# Altium project NiMH Battery Charger.PrjPcb
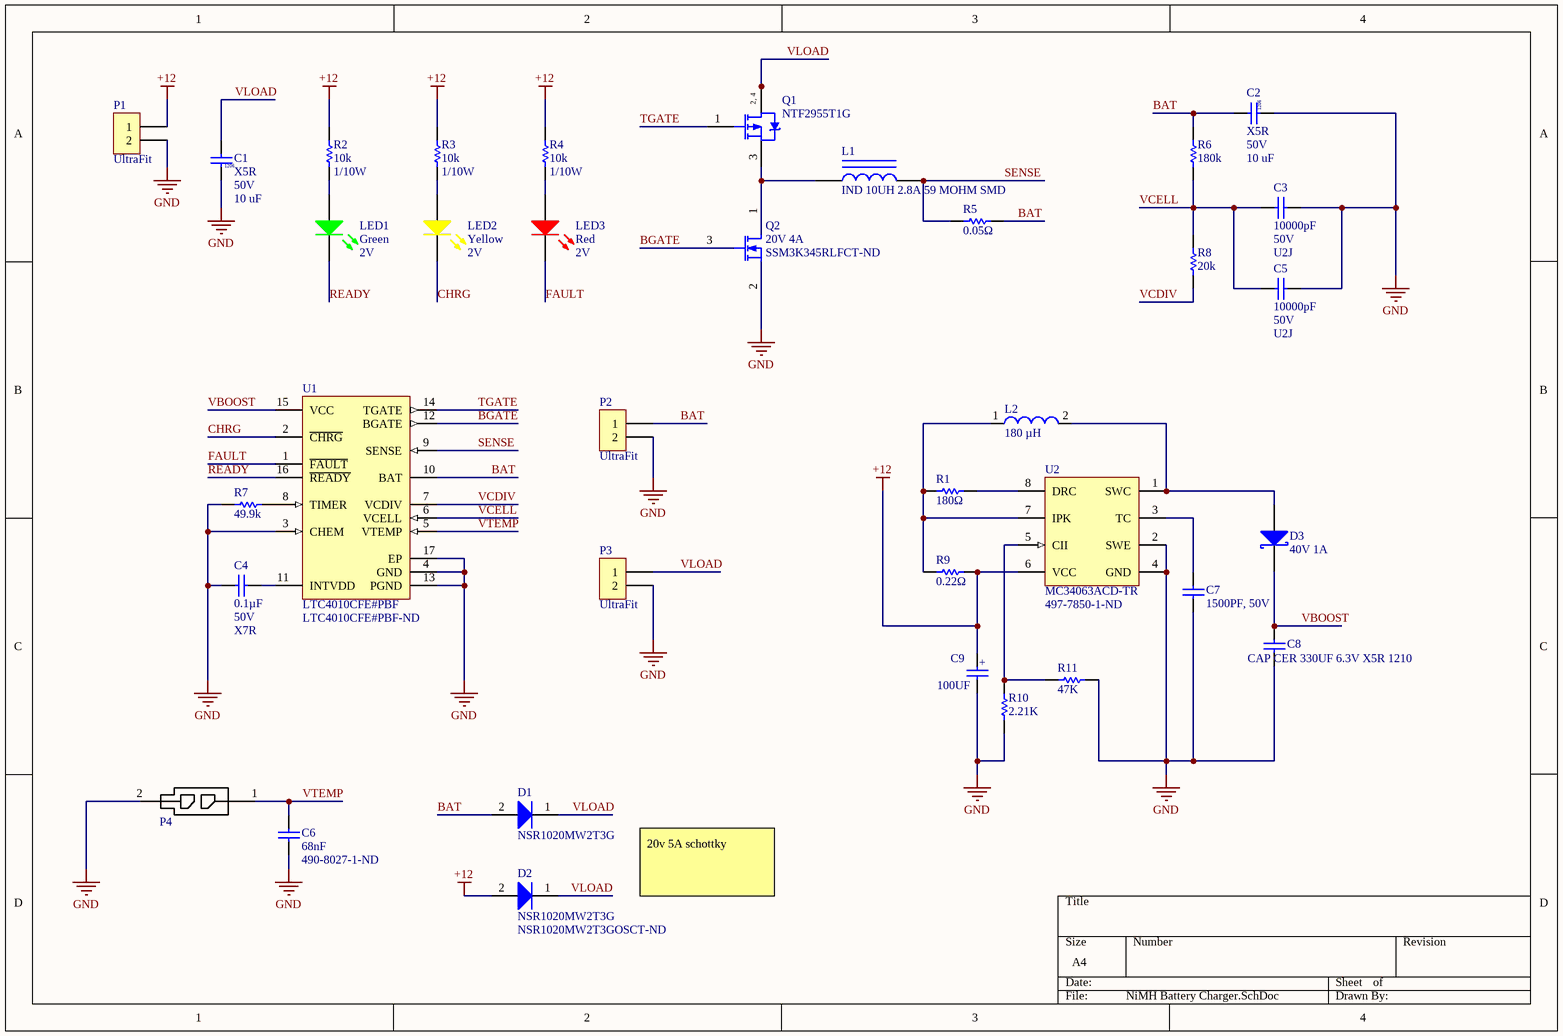
[diagram p0: NiMH Battery Charger.SchDoc]
1 sheet, 36 parts. Net scope: global (net labels, ports and power ports of the same name join across sheets).
Board file: NiMH Battery Charger Rev.PcbDoc

## Sheet NiMH Battery Charger.SchDoc
size A4

### Parts
C1  Rating: X5R  Voltage Rating: 50V  Capacitance: 10 uF  [CAP, 1206]  (hidden comment: CAP CER 10uF 50V 20% X5R 1206)
C2  Rating: X5R  Voltage Rating: 50V  Capacitance: 10 uF  [CAP, 1206]  (hidden comment: CAP CER 10uF 50V 20% X5R 1206)
C3  Capacitance: 10000pF  Voltage: 50V  Temperature Coefficient: U2J  [CAP, 0603]  (hidden comment: CAP CER 10nF 50V 5% X7R 0603)
C4  Capacitance: 0.1µF  Voltage: 50V  Temperature Coefficient: X7R  [CAP, 0603]  (hidden comment: CAP CER 0.1UF 50V 10% X7R 0603)
C5  Capacitance: 10000pF  Voltage: 50V  Temperature Coefficient: U2J  [CAP, 0603]  (hidden comment: CAP CER 10nF 50V 5% X7R 0603)
C6  68nF  Supplier Part Number 1: 490-8027-1-ND  [CAP, 0603]
C7  1500PF, 50V  [CAP, 0603]
C8  CAP CER 330UF 6.3V X5R 1210  [CAP, 1210]
C9  100UF  [CAP ALUM 6.3MM RADIAL SMD]
D1  NSR1020MW2T3G  [ONSC-SOD-323-2-477-02_V]
D2  NSR1020MW2T3G  Supplier Part Number 1: NSR1020MW2T3GOSCT-ND  [ONSC-SOD-323-2-477-02_V]
D3  40V 1A  [MELF]
L1  IND 10UH 2.8A 59 MOHM SMD  [INDP100102X31N]
L2  180 µH  [WE-PD-XL]
LED1  Color: Green  Voltage - Forward (Vf) (Typ): 2V  [LED_0603]  (hidden comment: LED GREEN CLEAR 2V 0603)
LED2  Color: Yellow  Voltage - Forward (Vf) (Typ): 2V  [LED_0603]  (hidden comment: LED YELLOW CLEAR 2.1V 0603)
LED3  Color: Red  Voltage - Forward (Vf) (Typ): 2V  [LED_0603]  (hidden comment: LED RED CLEAR 2V 0603)
P1  Series: UltraFit  [CONN, 2POS ULTRA-FIT]  (hidden comment: CONN 2POS ULTRA-FIT 0.138")
P2  Series: UltraFit  [CONN, 2POS ULTRA-FIT]  (hidden comment: CONN 2POS ULTRA-FIT 0.138")
P3  Series: UltraFit  [CONN, 2POS ULTRA-FIT]  (hidden comment: CONN 2POS ULTRA-FIT 0.138")
P4  CONN 2POS MICRO-FIT 3mm  [CONN, 2POS MICRO-FIT]  (value not drawn)
Q1  NTF2955T1G  [ONSC-SOT-223-4-318E-04_V]
Q2  20V 4A  Supplier Part Number 1: SSM3K345RLFCT-ND  [SOT23]
R1  180Ω  [RES, 0603]
R2  Resistance: 10k  Power: 1/10W  [RES, 0603]  (hidden comment: RES 10K OHM 1% 1/10W 0603)
R3  Resistance: 10k  Power: 1/10W  [RES, 0603]  (hidden comment: RES 10K OHM 1% 1/10W 0603)
R4  Resistance: 10k  Power: 1/10W  [RES, 0603]  (hidden comment: RES 10K OHM 1% 1/10W 0603)
R5  0.05Ω  [RES, 0603]
R6  180k  [RES, 0603]
R7  49.9k  [RES, 0603]
R8  20k  [RES, 0603]
R9  0.22Ω  [RES, 0603]
R10  2.21K  [RES, 0603]
R11  47K  [RES, 0603]
U1  LTC4010CFE#PBF  Supplier Part Number 1: LTC4010CFE#PBF-ND  [LT-FE-16-EPV-BC_L]
U2  MC34063ACD-TR  Supplier Part Number 1: 497-7850-1-ND  [SO8_N]

### Nets
+12: C9.1 D2.2(A) P1.1 R2.1 R3.1 R4.1 R9.1 U2.6(VCC)
GND: C1.2 C2.2 C3.2 C4.2 C5.2 C6.2 C7.2 C8.2 C9.2 P1.2 P2.2 P3.2 P4.2 Q2.2 R7.1 R10.2 R11.2 U1.3(CHEM) U1.4(GND) U1.13(PGND) U1.17(EP) U2.2(SWE) U2.4(GND)
BAT: C2.1 D1.2(A) P2.1 R5.2 R6.2 U1.10(BAT)
BGATE: Q2.3 U1.12(BGATE)
CHRG: LED2.2(K) U1.2(~{CHRG})
FAULT: LED3.2(K) U1.1(~{FAULT})
READY: LED1.2(K) U1.16(~{READY})
SENSE: L1.2 R5.1 U1.9(SENSE)
TGATE: Q1.1(G) U1.14(TGATE)
VBOOST: C8.1 D3.2(K) U1.15(VCC)
VCDIV: R8.1 U1.7(VCDIV)
VCELL: C3.1 C5.1 R6.1 R8.2 U1.6(VCELL)
VLOAD: C1.1 D1.1(K) D2.1(K) P3.1 Q1.2(D) Q1.4(D)
VTEMP: C6.1 P4.1 U1.5(VTEMP)
NetC4_1: C4.1 U1.11(INTVDD)
NetC7_1: C7.1 U2.3(TC)
NetD3_1: D3.1(A) L2.2 U2.1(SWC)
NetL1_1: L1.1 Q1.3(S) Q2.1
NetL2_1: L2.1 R1.2 R9.2 U2.7(IPK)
NetLED1_1: LED1.1(A) R2.2
NetLED2_1: LED2.1(A) R3.2
NetLED3_1: LED3.1(A) R4.2
NetR1_1: R1.1 U2.8(DRC)
NetR7_2: R7.2 U1.8(TIMER)
NetR10_1: R10.1 R11.1 U2.5(CII)

### Notes on the sheet
- 20v 5A schottky
- (in symbol CAP ALUM 100UF 20% 35V SMD) +
- (in symbol ONSC-PMOS-G1D2S3D4-4) 2, 4

### Library data of the parts
C1 C2 = CAP CER 10uF 50V 20% X5R 1206: 10µF ±20% 50V Ceramic Capacitor X5R 1206 (3216 Metric) /; Manufacturer: Murata; Manufacturer Part Number: GRT31CR61H106ME01L; Supplier 1: Digi-Key; Supplier Part Number 1: 490-12457-1-ND; RoHS: Yes; Stock 1: 449467; Pricing 1: 1 = 0.57000, 10 = 0.39800, 100 = 0.23910, 500 = 0.17930, 1000 = 0.15141 (USD); Mount: Surface Mount; Case/Package: 1206; Case Code (Metric): 3216; Case Code (Imperial): 1206; Min Operating Temperature: -55°C; Max Operating Temperature: 85°C; Packaging: Tape and Reel; Tolerance: 20%; Length: 0.126inch; Width: 0.063inch; Thickness: 0.071inch; Ratings: AEC-Q200
C3 C5 = CAP CER 10nF 50V 5% X7R 0603: 10000pF ±5% 50V Ceramic Capacitor U2J 0603 (1608 Metric); Manufacturer 1: KEMET; Manufacturer Part Number 1: C0603C103J5JAC7867; Supplier 1: Digi-Key; Supplier Part Number 1: 399-13384-1-ND; Packaging: Cut Tape (CT); Part Status: Active; Operating Temperature: -55°C ~ 125°C; Ratings: -; Failure Rate: -; Mounting Type: Surface Mount, MLCC; Package / Case: 0603 (1608 Metric); Size / Dimension: 0.063" L x 0.032" W (1.60mm x 0.80mm); Height - Seated (Max): -; Thickness (Max): 0.034" (0.87mm); Lead Spacing: -; Lead Style: -; ComponentLink1URL: http://www.kemet.com/docfinder?Partnumber=C0603C103J5JAC7867; ComponentLink1Description: http://www.kemet.com/docfinder?Partnumber=C0603C103J5JAC7867; Tolerance: ±5%
C4 = CAP CER 0.1UF 50V 10% X7R 0603: 0.10µF ±10% 50V Ceramic Capacitor X7R 0603 (1608 Metric); Manufacturer 1: AVX Corporation; Manufacturer Part Number 1: 06035C104KAT2A; Supplier 1: Digi-Key; Supplier Part Number 1: 478-5052-1-ND; Packaging: Cut Tape (CT); Part Status: Active; Operating Temperature: -55°C ~ 125°C; Ratings: -; Mounting Type: Surface Mount, MLCC; Package / Case: 0603 (1608 Metric); Size / Dimension: 0.063" L x 0.032" W (1.60mm x 0.81mm); Height - Seated (Max): -; Thickness (Max): 0.035" (0.90mm); Lead Spacing: -; Lead Style: -; ComponentLink1URL: http://datasheets.avx.com/X7RDielectric.pdf; ComponentLink1Description: http://datasheets.avx.com/X7RDielectric.pdf; Tolerance: ±10%
C6 = CAP CER 0.068UF 10% 50V X7R 0603: 0.068µF 50V Ceramic Capacitor X7R 0603 (1608 Metric) 0.063" L x 0.032" W (1.60mm x 0.80mm); Manufacturer: Murata; Manufacturer Part Number: GCM188R71H683KA57D; Tolerance: 10%; Supplier 1: Digi-Key; Stock 1: 40000; Pricing 1: 1=0.16, 10=0.116, 100=0.0547, 500=0.03832, 1000=0.03172 (USD); Mount: Surface Mount; Case/Package: 0603; Case Code (Metric): 1608; Case Code (Imperial): 0603; Min Operating Temperature: -55°C; Max Operating Temperature: 125°C; Packaging: Tape and Reel; Capacitance: 68nF; Package Quantity: 4000; Voltage Rating: 50V; Dielectric: X7R; Voltage Rating (DC): 50V; Termination: SMD/SMT; Length: 1.6mm; Height: 0.8mm; Width: 0.031inch; Thickness: 0.035inch; Depth: 0.8mm; Radiation Hardening: No; ComponentLink1URL: https://datasheet.ciiva.com/29542/s0717e-29542427.pdf; ComponentLink1Description: https://datasheet.ciiva.com/29542/s0717e-29542427.pdf; ComponentLink2URL: https://datasheet.ciiva.com/29542/s0717e-29542428.pdf; ComponentLink2Description: https://datasheet.ciiva.com/29542/s0717e-29542428.pdf; ComponentLink3URL: https://datasheet.ciiva.com/29542/s0717e-29542429.pdf; ComponentLink3Description: https://datasheet.ciiva.com/29542/s0717e-29542429.pdf
C7 = CAP, 1500PF, 50V, 10%, X7R, 0603: KEMET - C0603C152K5RACTU - CAP, 1500PF, 50V, 10%, X7R, 0603; Dielectric Material: Ceramic; Capacitance: 1.5nF; Dissipation Factor: 2.5%; Supplier 1: Digi-Key; Manufacturer 1: KEMET; Manufacturer Part Number 1: C0603C152K5RACTU; Stock 1: 207623; Pricing 1: 1=0.10000, 10=0.05000, 100=0.02230, 500=0.01594, 1000=0.01252 (USD); RoHS: Yes; Mount: Surface Mount,PCB; Case/Package: 0603; Number of Pins: 2; Case Code (Metric): 1608; Case Code (Imperial): 0603; Contact Plating: Tin,Matte; Min Operating Temperature: -55°C; Max Operating Temperature: 125°C; Tolerance: 10%; Voltage Rating: 50V; Packaging: Tape and Reel; Package Quantity: 1; Voltage Rating (DC): 50V; Dielectric: X7R; Termination: SMD/SMT; Voltage: 50V; Length: 1.6mm; Height: 0.8mm; Width: 0.8mm; Thickness: 0.034inch; Depth: 0.8mm; Lead Pitch: 0.7mm; Radiation Hardening: No; REACH SVHC: No SVHC; ComponentLink1URL: https://datasheet.ciiva.com/7824/kem-c1002-x7r-smd-7824006.pdf?src-supplier=Element14; ComponentLink1Description: https://datasheet.ciiva.com/7824/kem-c1002-x7r-smd-7824006.pdf?src-supplier=Element14; ComponentLink2URL: https://datasheet.ciiva.com/28645/1851736-28645673.pdf?src-supplier=Element14; ComponentLink2Description: https://datasheet.ciiva.com/28645/1851736-28645673.pdf?src-supplier=Element14; ComponentLink3URL: https://datasheet.ciiva.com/7823/40889-7823642.pdf?src-supplier=Element14; ComponentLink3Description: https://datasheet.ciiva.com/7823/40889-7823642.pdf?src-supplier=Element14; ComponentLink4URL: https://datasheet.ciiva.com/18192/getdatasheetpartid-104358-18192810.pdf?src-supplier=Verical; ComponentLink4Description: https://datasheet.ciiva.com/18192/getdatasheetpartid-104358-18192810.pdf?src-supplier=Verical; ComponentLink5URL: https://datasheet.ciiva.com/7823/40889-7823643.pdf?src-supplier=Element14; ComponentLink5Description: https://datasheet.ciiva.com/7823/40889-7823643.pdf?src-supplier=Element14; ComponentLink6URL: https://datasheet.ciiva.com/6177/kem-c1002-x7r-smd-6177916.pdf?src-supplier=Farnell; ComponentLink6Description: https://datasheet.ciiva.com/6177/kem-c1002-x7r-smd-6177916.pdf?src-supplier=Farnell; ComponentLink7URL: https://datasheet.ciiva.com/14597/70095383-14597806.pdf?src-supplier=Allied+Electronics; ComponentLink7Description: https://datasheet.ciiva.com/14597/70095383-14597806.pdf?src-supplier=Allied+Electronics
C8 = CAP CER 330UF 6.3V X5R 1210: 330µF ±20% 6.3V Ceramic Capacitor X5R 1210 (3225 Metric); Manufacturer: Taiyo Yuden; Manufacturer Part Number: JMK325ABJ337MM-P; Supplier 1: Digi-Key; Stock 1: 1427; Pricing 1: 1=5.57, 10=4.492, 100=3.5039, 500=2.6055 (USD); Supplier Part Number 1: 587-5449-1-ND
C9 = CAP ALUM 100UF 20% 35V SMD: 100µF 35V Aluminum Electrolytic Capacitors Radial, Can - SMD 2000 Hrs @ 85°C; Manufacturer 1: Panasonic; Manufacturer Part Number 1: EEE-1VA101XP; Description 1: Cap Aluminum Lytic 100uF 35V 20% (6.3 X 7.7mm) SMD 132mA 2000h 85C Automotive T/R; Tolerance: 20%; Ripple Current: 132mA; Polarity: Polar; Life (Hours): 2000Hour; Leakage Current: 3uA; Supplier 1: Digi-Key; Supplier Part Number 1: PCE3951CT-ND; Stock 1: 170823; Pricing 1: 1=0.44, 10=0.304, 100=0.1822 (USD); Mount: Surface Mount,PCB; Case/Package: Radial; Number of Pins: 8; Contact Plating: Tin; Min Operating Temperature: -40°C; Max Operating Temperature: 85°C; Capacitance: 100uF; Voltage Rating: 35V; Packaging: Tape and Reel; Package Quantity: 900; Ripple Current (AC): 132mA; Voltage Rating (DC): 35V; Termination: SMD/SMT; Voltage: 35V; Diameter: 6.3mm; Length: 8mm; Height: 7.7mm; Height - Seated (Max): 0.303inch; Radiation Hardening: No; REACH SVHC: No SVHC; Lead Free: Lead Free; ComponentLink1URL: https://datasheet.ciiva.com/46378/aba0000ce2-46378341.pdf; ComponentLink1Description: https://datasheet.ciiva.com/46378/aba0000ce2-46378341.pdf; ComponentLink2URL: https://datasheet.ciiva.com/17535/aba0000ce2-17535510.pdf; ComponentLink2Description: https://datasheet.ciiva.com/17535/aba0000ce2-17535510.pdf; ComponentLink3URL: https://datasheet.ciiva.com/30170/11aba0000ce2-30170103.pdf; ComponentLink3Description: https://datasheet.ciiva.com/30170/11aba0000ce2-30170103.pdf; ComponentLink4URL: https://datasheet.ciiva.com/31414/aba0000ce2-31414696.pdf; ComponentLink4Description: https://datasheet.ciiva.com/31414/aba0000ce2-31414696.pdf; ComponentLink5URL: https://datasheet.ciiva.com/24068/aba0000ce2-40801-24068089.pdf; ComponentLink5Description: https://datasheet.ciiva.com/24068/aba0000ce2-40801-24068089.pdf; ComponentLink6URL: https://datasheet.ciiva.com/14591/70255710-14591771.pdf; ComponentLink6Description: https://datasheet.ciiva.com/14591/70255710-14591771.pdf; ComponentLink7URL: https://datasheet.ciiva.com/14600/70255710-14600731.pdf; ComponentLink7Description: https://datasheet.ciiva.com/14600/70255710-14600731.pdf; ComponentLink8URL: https://datasheet.ciiva.com/46374/aba0000ce2-46374427.pdf; ComponentLink8Description: https://datasheet.ciiva.com/46374/aba0000ce2-46374427.pdf; ComponentLink9URL: https://datasheet.ciiva.com/11673/aba0000ce2-11673887.pdf; ComponentLink9Description: https://datasheet.ciiva.com/11673/aba0000ce2-11673887.pdf
D1 = CMP-1055-00469-1: Schottky Barrier Diode, 2-Pin SOD-323, Pb-Free, Tape and Reel; Manufacturer: On Semiconductor; IFSM Max (A): 5; Configuration: Single; PartNumber: NSR1020MW2T3G; RoHS: TRUE; ComponentLink2Description: Datasheet; PackageVersion: Rev. H, 03/2007; ComponentLink3Description: Package Specification; ComponentLink1Description: Manufacturer URL; DatasheetVersion: Rev. 1; PackageDescription: 2-Pin SOD, Body 1.7 x 1.25 mm; ComponentLink2URL: http://www.onsemi.cn/pub_link/Collateral/NSR1020MW2T1-D.PDF; Packing: Tape and Reel; ComponentLink3URL: http://www.onsemi.com/pub_link/Collateral/477-02.PDF.1; PackageReference: SOD-323-2-477-02; ComponentLink1URL: http://www.onsemi.com/; Mounting Technology: Surface Mount
D2 = DIODE Schottky Barrier 20V: Schottky Barrier Diode, 2-Pin SOD-323, Pb-Free, Tape and Reel; Manufacturer: On Semiconductor; IFSM Max (A): 5; Configuration: Single; PartNumber: NSR1020MW2T3G; RoHS: TRUE; ComponentLink2Description: Datasheet; PackageVersion: Rev. H, 03/2007; ComponentLink3Description: Package Specification; ComponentLink1Description: Manufacturer URL; DatasheetVersion: Rev. 1; PackageDescription: 2-Pin SOD, Body 1.7 x 1.25 mm; ComponentLink2URL: http://www.onsemi.cn/pub_link/Collateral/NSR1020MW2T1-D.PDF; Packing: Tape and Reel; ComponentLink3URL: http://www.onsemi.com/pub_link/Collateral/477-02.PDF.1; PackageReference: SOD-323-2-477-02; ComponentLink1URL: http://www.onsemi.com/; Mounting Technology: Surface Mount; Supplier 1: Digi-Key
D3 = DIODE SCHOTTKY 40V 1A MELF: Diode Schottky 40V 1A Surface Mount MELF
L1 = IND 10UH 2.8A 59 MOHM SMD: 10µH Shielded Inductor 2.8A 59 mOhm Max Nonstandard; Manufacturer: Sumida; Manufacturer Part Number: CDRH103RNP-100NC-B; Core Material: Ferrite; Tolerance: 30%; Saturation Current: 3.18A; DC Resistance (DCR): 59mR; Test Frequency: 100kHz; Supplier 1: Digi-Key; Stock 1: 69; Pricing 1: 1=1.53, 10=1.42, 100=1.027, 500=0.7866 (USD); Mount: Surface Mount; Case/Package: Nonstandard; Min Operating Temperature: -40°C; Max Operating Temperature: 100°C; Packaging: Tape and Reel; Package Quantity: 1000; Current Rating: 2.8A; Shielding: Shielded; Inductance: 10uh; Max DC Current: 2.8A; Termination: SMD/SMT; Length: 0.402inch; Height: 3.1mm; Width: 0.394inch; Height - Seated (Max): 0.122inch; Depth: 10.3mm; Radiation Hardening: No; Lead Free: Lead Free; ComponentLink1URL: http://www.mouser.com/ds/2/390/CDRH103R-523372.pdf; ComponentLink1Description: http://www.mouser.com/ds/2/390/CDRH103R-523372.pdf; ComponentLink2URL: http://www.sumida.com/products/pdf/CDRH103R.pdf; ComponentLink2Description: http://www.sumida.com/products/pdf/CDRH103R.pdf; ComponentLink3URL: http://products.sumida.com/products/pdf/CDRH103R.pdf; ComponentLink3Description: http://products.sumida.com/products/pdf/CDRH103R.pdf; Supplier Part Number 1: 308-1910-1-ND
L2 = IND 180 µH Power Inductor: SMD-Shielded Power Inductor WE-PD, L = 180 µH; Inductance: 180 ÂµH; ComponentLink1URL: http://www.we-online.com; DatasheetVersion: ver 5, Oct-2004; ComponentLink1Description: Manufacturer Link; ComponentLink2URL: http://www.we-online.de/katalog/media/pdf/744770218.pdf; PackageDescription: SMD Inductor, 2-Leads, Body 12.0 x 12.0 mm; PackageReference: WE-PD-XL; ComponentLink2Description: Datasheet; PackageVersion: 2004
LED1 = LED GREEN CLEAR 2V 0603: Green 572nm LED Indication - Discrete 2V 0603 (1608 Metric); Manufacturer: Wurth Electronics Inc.; Manufacturer Part Number: 150060VS75000; Lens Color: Colorless; Millicandela Rating: 40mcd; Lens Style/Size: Rectangle with Flat Top, 1.10mm x 0.70mm; Current - Test: 20mA; Viewing Angle: 140°; Wavelength - Dominant: 570nm; Supplier 1: Digi-Key; RoHS: RoHS Compliant; Category: Optoelectronics; Stock 1: 9408; Pricing 1: 1=0.21, 100=0.1617, 500=0.13964 (CAD); Packaging: Cut Tape (CT); Part Status: Active; Lens Transparency: Clear; Mounting Type: Surface Mount; Wavelength - Peak: 572nm; Features: -; Package / Case: 0603 (1608 Metric); Supplier Device Package: 0603; Size / Dimension: 1.60mm L x 0.80mm W; Height (Max): 0.80mm; ComponentLink1URL: http://katalog.we-online.de/led/datasheet/150060VS75000.pdf; ComponentLink1Description: http://katalog.we-online.de/led/datasheet/150060VS75000.pdf; Supplier Part Number 1: 732-4980-1-ND
LED2 = LED YELLOW CLEAR 2.1V 0603: Yellow 590nm LED Indication - Discrete 2V 0603 (1608 Metric); Manufacturer: Wurth Electronics Inc.; Manufacturer Part Number: 150060YS75000; Lens Color: Colorless; Millicandela Rating: 120mcd; Lens Style/Size: Rectangle with Flat Top, 1.10mm x 0.70mm; Current - Test: 20mA; Viewing Angle: 140°; Wavelength - Peak: 595nm; Supplier 1: Digi-Key; RoHS: RoHS Compliant; Category: Optoelectronics; Stock 1: 10523; Pricing 1: 1=0.21, 100=0.1617, 500=0.13964 (CAD); Packaging: Cut Tape (CT); Part Status: Active; Lens Transparency: Clear; Mounting Type: Surface Mount; Wavelength - Dominant: 590nm; Features: -; Package / Case: 0603 (1608 Metric); Supplier Device Package: 0603; Size / Dimension: 1.60mm L x 0.80mm W; Height (Max): 0.80mm; ComponentLink1URL: http://katalog.we-online.de/led/datasheet/150060YS75000.pdf; ComponentLink1Description: http://katalog.we-online.de/led/datasheet/150060YS75000.pdf; Supplier Part Number 1: 732-4981-1-ND
LED3 = LED RED CLEAR 2V 0603: Red 631nm LED Indication - Discrete 2V 0603 (1608 Metric); Manufacturer: Wurth Electronics Inc.; Manufacturer Part Number: 150060RS75000; Lens Color: Colorless; Millicandela Rating: 250mcd; Lens Style/Size: Rectangle with Flat Top, 1.10mm x 0.70mm; Current - Test: 20mA; Viewing Angle: 140°; Wavelength - Dominant: 625nm; Wavelength - Peak: 630nm; Supplier 1: Digi-Key; RoHS: RoHS Compliant; Category: Optoelectronics; Stock 1: 35521; Pricing 1: 1=0.21, 100=0.1617, 500=0.13964 (CAD); Packaging: Cut Tape (CT); Part Status: Active; Lens Transparency: Clear; Mounting Type: Surface Mount; Features: -; Package / Case: 0603 (1608 Metric); Supplier Device Package: 0603; Size / Dimension: 1.60mm L x 0.80mm W; Height (Max): 0.80mm; ComponentLink1URL: http://katalog.we-online.de/led/datasheet/150060RS75000.pdf; ComponentLink1Description: http://katalog.we-online.de/led/datasheet/150060RS75000.pdf; Supplier Part Number 1: 732-4978-1-ND
P1-P3 = CONN 2POS ULTRA-FIT 0.138": Connector Header Through Hole 2 position 0.138" (3.50mm); Manufacturer: Molex; Manufacturer Part Number: 1722871102; Number of Positions: 2; Connector Type: Male Pin; Pitch: 0.138inch; ComponentLink1URL: http://www.molex.com/pdm_docs/sd/1722861302_sd.pdf; ComponentLink1Description: http://www.molex.com/pdm_docs/sd/1722861302_sd.pdf; Supplier 1: Digi-Key; RoHS: Yes; Stock 1: 2743; Pricing 1: 1 = 0.78000, 10 = 0.68800, 100 = 0.59380, 500 = 0.48582, 1000 = 0.43184, 5000 = 0.37786, 10000 = 0.35897 (USD); Mount: Through Hole; Color: Black; Contact Plating: Tin; Packaging: Tray; Number of Rows: 1; Termination: Solder; Fastening Type: Latch; Supplier Part Number 1: WM11701-ND
P4 = CONN 2POS MICRO-FIT 3mm: Connector Header Through Hole 2 position; Manufacturer: Molex; Manufacturer Part Number: 43045-0227; Number of Positions: 2; Gender: Male; Contact Resistance: 10mR; Number of Ports: 1; Max Voltage Rating (DC): 250.25kV; Current Rating: 5A; Voltage Rating: 600V; Glow Wire Compliant: Compliant; Supplier 1: Digi-Key; Stock 1: 3657; Pricing 1: 1=0.84, 10=0.74, 25=0.6968, 50=0.6676, 100=0.6387, 250=0.5806, 500=0.52254, 1000=0.46448, 2500=0.42094 (USD); Mount: Through Hole; Contact Plating: Tin; Contact Material: Brass; Housing Colour: Black; Housing Material: Thermoplastic; Number of Terminals: 2; Min Operating Temperature: -40°C; Max Operating Temperature: 105°C; Number of Rows: 2; Packaging: Tray; Termination: Solder; Number of Contacts: 2; Orientation: Vertical; Package Quantity: 3168; Number of Circuits: 2; Length: 7.15mm; Pitch: 3mm; Depth: 8.77mm; Row Spacing: 3mm; Radiation Hardening: No; Halogen Free: Low Halogen; ComponentLink1URL: http://www.onlinecomponents.com/productFiles/mf-MOL/307170430450227_pcb_headers.pdf; ComponentLink1Description: http://www.onlinecomponents.com/productFiles/mf-MOL/307170430450227_pcb_headers.pdf; ComponentLink2URL: http://www.mouser.com/ds/2/276/0430450227_PCB_HEADERS-142611.pdf; ComponentLink2Description: http://www.mouser.com/ds/2/276/0430450227_PCB_HEADERS-142611.pdf; ComponentLink3URL: http://uk.rs-online.com/webdocs/13c3/0900766b813c3a46.pdf; ComponentLink3Description: http://uk.rs-online.com/webdocs/13c3/0900766b813c3a46.pdf; ComponentLink4URL: http://www.molex.com/webdocs/datasheets/pdf/en-us/0430450227_PCB_HEADERS.pdf; ComponentLink4Description: http://www.molex.com/webdocs/datasheets/pdf/en-us/0430450227_PCB_HEADERS.pdf; Supplier Part Number 1: WM10657-ND
Q1 = ONSC-PMOS-G1D2S3D4-4: Power MOSFET, -60 V, -2.6 A, Single P-Channel, 4-Pin SOT-223, Pb-Free, Tape and Reel; Manufacturer: On Semiconductor; Ciss Typ (pF): 492; Coss Typ (pF): 165; VGS(th) Max (V): 4; VGS Max (V): 20; ID Max (A): 2.6; Crss Typ (pF): 50; Channel Polarity: P Channel; V(BR)DSS Min (V): 60; Qrr Typ (nC): 0.139; Mounting Technology: Surface Mount; RoHS: Pb-Free; ComponentLink3URL: http://www.onsemi.com/pub_link/Collateral/318E-04.PDF; Packing: Tape and Reel; ComponentLink1URL: http://www.onsemi.com/; PackageReference: SOT-223-4-318E-04; Configuration: Single; PartNumber: NTF2955T1G; ComponentLink3Description: Package Specification; DatasheetVersion: Rev. 6; ComponentLink2Description: Datasheet; ComponentLink2URL: http://www.onsemi.com/pub_link/Collateral/NTF2955-D.PDF; PackageDescription: 4-Pin Small Outline Transistor, Body 6.5 x 3.5 mm, Pitch 2.3 mm; Package Type: SOT-223-4 / TO-261-4; ComponentLink1Description: Manufacturer URL; PackageVersion: Rev. N, 08/2009
Q2 = MOSFET N-CHANNEL 20V 4A SOT23F: N-Channel 20V 4A (Ta) 1W (Ta) Surface Mount SOT-23F; Supplier 1: Digi-Key; ComponentLink1Description: datasheet; ComponentLink1URL: https://toshiba.semicon-storage.com/info/docget.jsp?did=55842&prodName=SSM3K345R
R1 R9 = RES 180k Ohms: Manufacturer: Vishay Dale; Part Number: CRCW0402180KFKED; Supplier 1: Digi-Key
R2-R4 = RES 10K OHM 1% 1/10W 0603: RES SMD 10K OHM 1% 1/10W 0603; Manufacturer 1: Yageo; Manufacturer Part Number 1: RC0603FR-0710KL; Temperature Coefficient: ±100ppm/°C; Supplier 1: Digi-Key; Supplier Part Number 1: 311-10.0KHRCT-ND; Packaging: Cut Tape (CT); Part Status: Active; Composition: Thick Film; Operating Temperature: -55°C ~ 155°C; Package / Case: 0603 (1608 Metric); Supplier Device Package: 0603; Size / Dimension: 0.063" L x 0.031" W (1.60mm x 0.80mm); Height - Seated (Max): 0.022" (0.55mm); Failure Rate: -; ComponentLink1URL: http://www.yageo.com/documents/recent/PYu-RC_Group_51_RoHS_L_7.pdf; ComponentLink1Description: http://www.yageo.com/documents/recent/PYu-RC_Group_51_RoHS_L_7.pdf; Tolerance: ±1%
R5 = RES-2: Chip Resistor, 50 mOhm, +/- 1%, 1 W, -65 to 170 degC, 2512 (6432 Metric), RoHS, Tape and Reel; Manufacturer: Vishay; Power Rating: 1W; Automotive Qualification Standard: AEC-Q200; Temperature Coefficient: ±75ppm/°C; Resistor Case Style: 2512[6432Metric]; SVHC: NoSVHC(15-Jun-2015); Product Range: WSLSeries; Resistance: 0.05ohm; Resistor Element Type: MetalStrip; Manufacturer URL: http://www.vishay.com/; Datasheet Version: 07/2016; Package Reference: 2512; Resistance Tolerance: ±1%; Datasheet URL: http://www.vishay.com/docs/30100/wsl.pdf; Mounting Technology: SurfaceMount; MSL: MSL1-Unlimited; Package Description: 2-Pin Surface Mount Device, Body 6.35 x 3.18 mm; Packaging: CutTape
R6 = RES: Manufacturer: Vishay Dale; Part Number: CRCW0402180KFKED
R7 = CMP-2002-05244-1: Manufacturer: Bourns; Part Number: CR0402-FX-4992GLF
R8 = RES: Part Number: CRCW040220K0FKED; Manufacturer: Vishay Dale
R10 = RES 2.21K OHM 1% 1/10W 0603: 2.21 kOhms ±1% 0.1W, 1/10W Chip Resistor 0603 (1608 Metric) Automotive AEC-Q200, Moisture Resistant Thick Film; Manufacturer: Yageo; Manufacturer Part Number: AC0603FR-072K21L; Voltage Rating: 50V; Resistance: 2.21kR; Power Rating: 100mW; Temperature Coefficient: 100ppm/°C; Working Voltage: 75V; Supplier 1: Digi-Key; Stock 1: 11020; Pricing 1: 1=0.1, 10=0.029, 100=0.0117, 1000=0.00527, 2500=0.00458 (USD); Case/Package: 0603; Weight: 7.1E-05oz; Case Code (Imperial): 0603; Case Code (Metric): 1608; Min Operating Temperature: -55°C; Max Operating Temperature: 155°C; Tolerance: 1%; Packaging: Tape and Reel; Composition: Thick Film; Termination: SMD/SMT; Number of Terminations: 2; Max Power Dissipation: 100mW; Length: 0.063inch; Height: 0.022inch; Width: 0.8mm; Lead Free: Lead Free; ComponentLink1URL: https://datasheet.ciiva.com/12576/pyu-ac-51-rohs-l-2-12576458.pdf; ComponentLink1Description: https://datasheet.ciiva.com/12576/pyu-ac-51-rohs-l-2-12576458.pdf; Supplier Part Number 1: YAG3586CT-ND
R11 = RES 47K OHM 1% 1/10W 0603: RES SMD 47K OHM 1% 1/10W 0603; Manufacturer 1: Vishay; Manufacturer Part Number 1: CRCW060347K0FKEA; Resistance: 47kR; Power Rating: 100mW; Temperature Coefficient: 100ppm/°C; Voltage Rating: 75V; Supplier 1: Digi-Key; Stock 1: 303029; Pricing 1: 1=0.10000, 10=0.03600, 100=0.01460, 1000=0.00654, 2500=0.00568 (USD); RoHS: Yes; Mount: Surface Mount; Case/Package: 0603; Weight: 7.1E-05oz; Case Code (Imperial): 0603; Case Code (Metric): 1608; Contact Plating: Tin; Min Operating Temperature: -55°C; Max Operating Temperature: 155°C; Packaging: Tape and Reel; Tolerance: 1%; Composition: Thick Film; Voltage Rating (DC): 75V; Termination: SMD/SMT; Package Quantity: 5000; Military Standard: Not; Length: 1.55mm; Height: 0.45mm; Width: 0.85mm; Depth: 0.85mm; Radiation Hardening: No; Lead Free: Lead Free; REACH SVHC: Unknown; ComponentLink1URL: https://datasheet.ciiva.com/11808/0900766b80d98afc-11808694.pdf?src-supplier=RSComponents; ComponentLink1Description: https://datasheet.ciiva.com/11808/0900766b80d98afc-11808694.pdf?src-supplier=RSComponents; ComponentLink2URL: https://datasheet.ciiva.com/16763/70201119-16763141.pdf?src-supplier=Allied+Electronics; ComponentLink2Description: https://datasheet.ciiva.com/16763/70201119-16763141.pdf?src-supplier=Allied+Electronics; ComponentLink3URL: https://datasheet.ciiva.com/16893/dcrcwe3-16893430.pdf?src-supplier=Avnet+Europe; ComponentLink3Description: https://datasheet.ciiva.com/16893/dcrcwe3-16893430.pdf?src-supplier=Avnet+Europe; ComponentLink4URL: https://datasheet.ciiva.com/5548/dcrcwe3-109170-5548727.pdf?src-supplier=Mouser; ComponentLink4Description: https://datasheet.ciiva.com/5548/dcrcwe3-109170-5548727.pdf?src-supplier=Mouser; ComponentLink5URL: https://datasheet.ciiva.com/7777/1720486-7777607.pdf?src-supplier=Element14; ComponentLink5Description: https://datasheet.ciiva.com/7777/1720486-7777607.pdf?src-supplier=Element14; ComponentLink6URL: https://datasheet.ciiva.com/7777/125364-7777562.pdf?src-supplier=Element14; ComponentLink6Description: https://datasheet.ciiva.com/7777/125364-7777562.pdf?src-supplier=Element14; ComponentLink7URL: https://datasheet.ciiva.com/3257/dcrcwe3-3257631.pdf?src-supplier=Avnet; ComponentLink7Description: https://datasheet.ciiva.com/3257/dcrcwe3-3257631.pdf?src-supplier=Avnet; ComponentLink8URL: https://datasheet.ciiva.com/16286/dcrcwe3-16286447.pdf?src-supplier=Future+Electronics; ComponentLink8Description: https://datasheet.ciiva.com/16286/dcrcwe3-16286447.pdf?src-supplier=Future+Electronics
U1 = IC Nickel Battery Charger: High Efficiency Standalone Nickel Battery Charger, 4.5 to 34 V Vin, 16-pin SOP (FE-16-EPV-BC), 0 to 85 degC, Pb-Free; Manufacturer: Linear Technology; Vin Max(V): 34; Vin Min(V): 4.5; Float Voltage: Adj; Battery Chemistry: NiCd, NiMH; Max Charge Current(A): 4; Number of Cells: 1 to 16; Type of Charger: Switching; Mounting Technology: Surface Mount; ComponentLink3Description: Package Specification; PackageVersion: Rev. J, 11/2012; PartNumber: LTC4010CFE#PBF; ComponentLink3URL: http://cds.linear.com/docs/en/packaging/05081663__J_FE16(BC).pdf; RoHS: TRUE; PackageDescription: 16-Pin Plastic TSSOP, Body 5 x 4.4 mm, Pitch 0.65 mm; ComponentLink1URL: http://www.linear.com/; DatasheetVersion: Rev. B; PackageReference: FE-16; ComponentLink1Description: Manufacturer URL; ComponentLink2Description: Datasheet; ComponentLink2URL: http://cds.linear.com/docs/en/datasheet/4010fb.pdf; Supplier 1: Digi-Key
U2 = IC Buck boost converter MC34063: DC/DC converter control circuit, 8-Pin SO, Tape and Reel; Code_IPC: SOIC127P600-8; ComponentLink2Description: Datasheet; ComponentLink3Description: Package Specification; PackageDescription: 8-Pin Small Outline Integrated Circuit 1.27 mm Pitch; Code_JEDEC: MS-012-AA; ComponentLink3URL: http://www.st.com/internet/com/TECHNICAL_RESOURCES/TECHNICAL_LITERATURE/PACKAGE_INFORMATION/CD00004680.pdf; ComponentLink1Description: Manufacturer URL; ComponentLink1URL: http://www.st.com; DatasheetVersion: Nov-2007; ComponentLink2URL: http://www.st.com/internet/com/TECHNICAL_RESOURCES/TECHNICAL_LITERATURE/DATASHEET/CD00001232.pdf; PackageReference: SO8; PackageVersion: Dec-2002; Supplier 1: Digi-Key